# EAGLE design Monster_Moto_Shield (EAGLE 6.5.0)
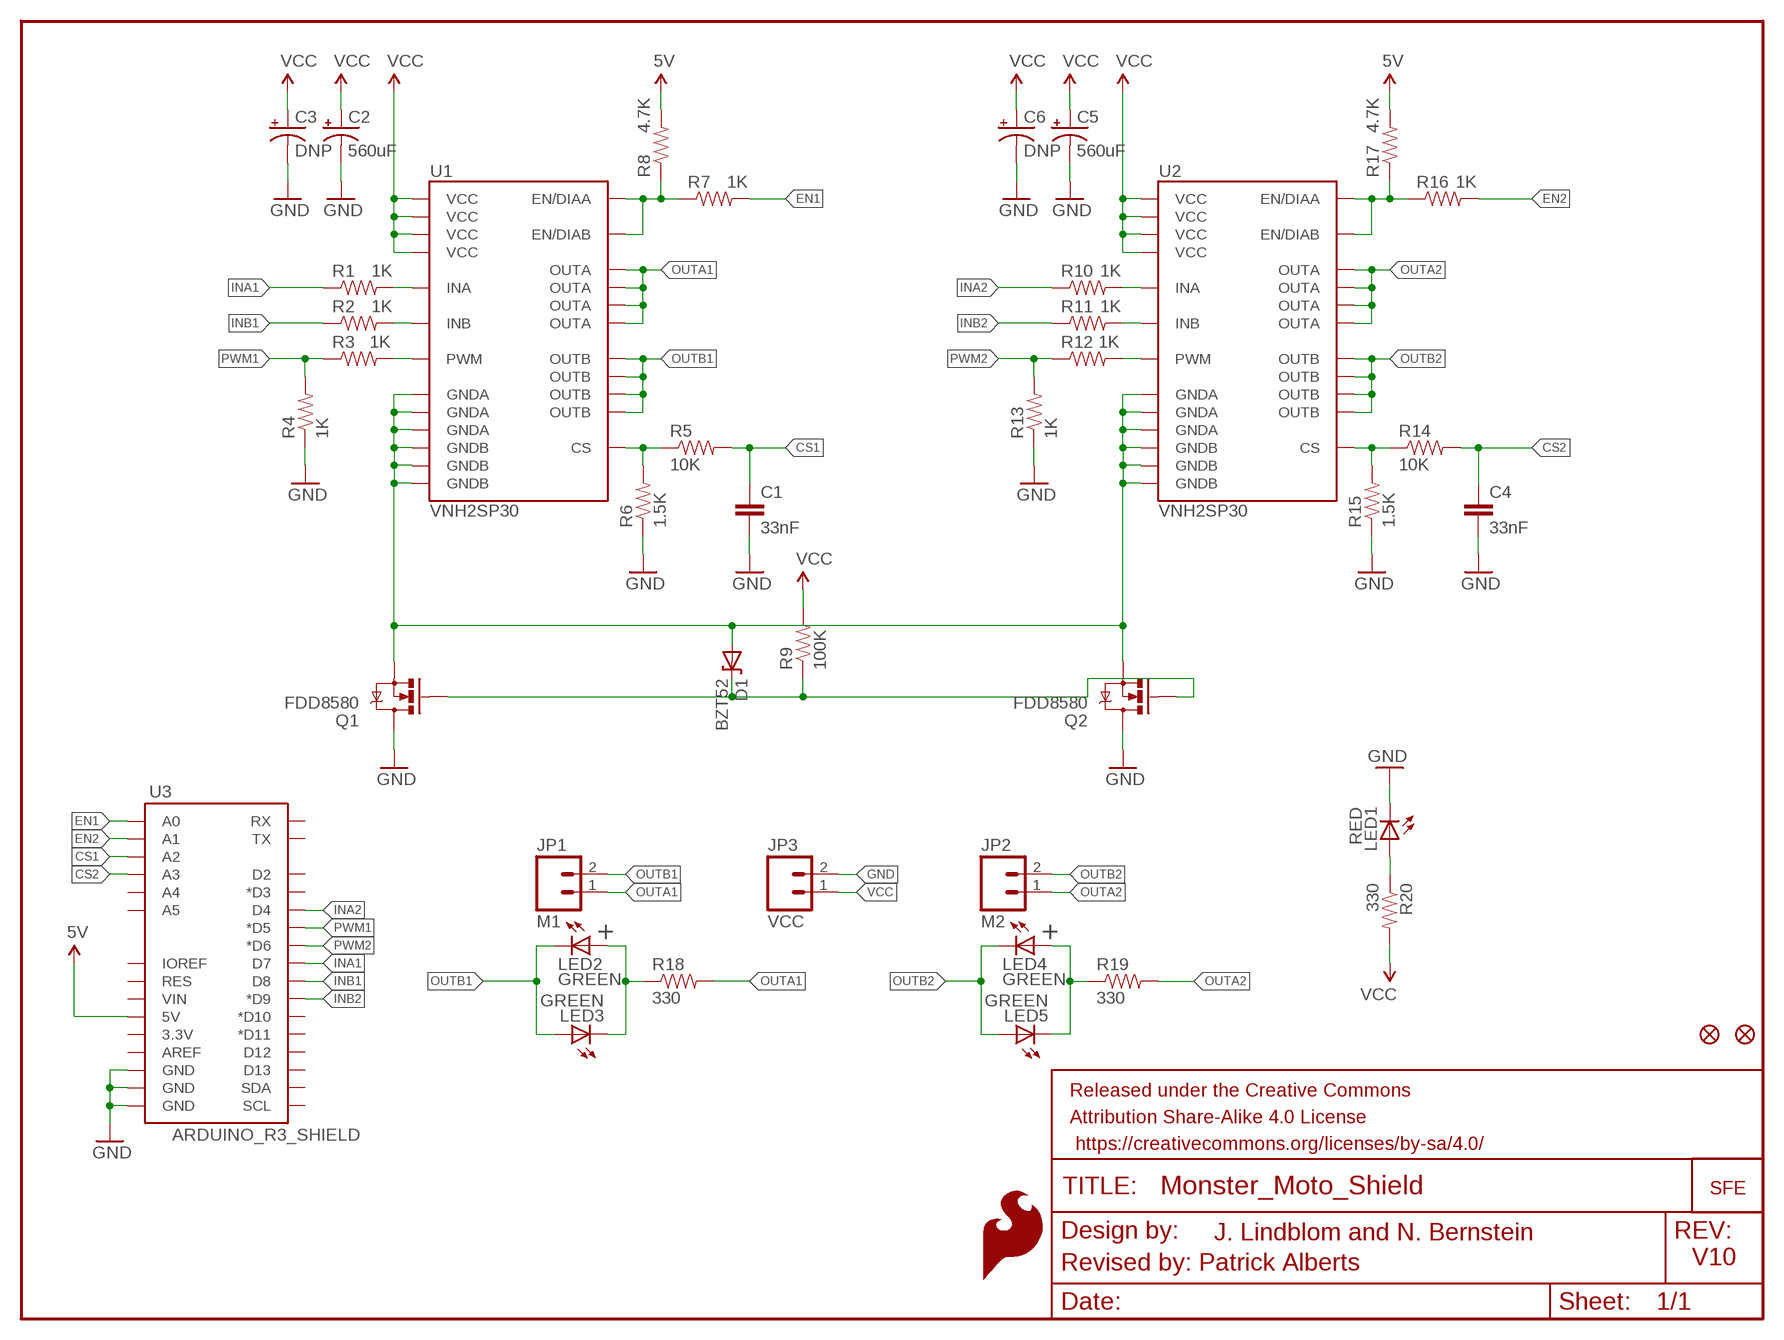
[diagram p0: schematic, sheet 1]

## Parts
C1  33nF  CAP0603-CAP  [0603-CAP]
C2  560uF  CAP_POLG  [PANASONIC_G]
C3  DNP  CAP_POLPTH4  [CPOL-RADIAL-1000UF-25V]
C4  33nF  CAP0603-CAP  [0603-CAP]
C5  560uF  CAP_POLG  [PANASONIC_G]
C6  DNP  CAP_POLPTH4  [CPOL-RADIAL-1000UF-25V]
D1  BZT52  DIODE-ZENER-BZT52  [SOD-323]
FRAME*  FRAME-LETTER  [CREATIVE_COMMONS]
JP1  M1  M02PTH4  [1X02_XTRA_BIG]
JP2  M2  M02PTH4  [1X02_XTRA_BIG]
JP3  VCC  M02PTH4  [1X02_XTRA_BIG]
JP4  FIDUCIAL1X2  [FIDUCIAL-1X2]
JP5  LOGO-SFENEW  [SFE-NEW-WEBLOGO]
JP6  FIDUCIAL1X2  [FIDUCIAL-1X2]
LED1  RED  LED-RED0603  [LED-0603]
LED2  GREEN  LED-GREEN0603  [LED-0603]
LED3  GREEN  LED-GREEN0603  [LED-0603]
LED4  GREEN  LED-GREEN0603  [LED-0603]
LED5  GREEN  LED-GREEN0603  [LED-0603]
LOGO1  SFE_LOGO_FLAME.2_INCH  [SFE_LOGO_FLAME_.2]
Q1  FDD8580  MOSFET-NCHANNELFDD8580  [DPAK]
Q2  FDD8580  MOSFET-NCHANNELFDD8580  [DPAK]
R1  1K  1KOHM1/10W1%(0603)  [0603-RES]
R2  1K  1KOHM1/10W1%(0603)  [0603-RES]
R3  1K  1KOHM1/10W1%(0603)  [0603-RES]
R4  1K  1KOHM1/10W1%(0603)  [0603-RES]
R5  10K  10KOHM1/10W1%(0603)0603  [0603-RES]
R6  1.5K  1.5KOHM1/10W1%(0603)  [0603]
R7  1K  1KOHM1/10W1%(0603)  [0603-RES]
R8  4.7K  4.7KOHM1/10W1%(0603)  [0603]
R9  100K  100KOHM1/10W1%(0603)  [0603-RES]
R10  1K  1KOHM1/10W1%(0603)  [0603-RES]
R11  1K  1KOHM1/10W1%(0603)  [0603-RES]
R12  1K  1KOHM1/10W1%(0603)  [0603-RES]
R13  1K  1KOHM1/10W1%(0603)  [0603-RES]
R14  10K  10KOHM1/10W1%(0603)0603  [0603-RES]
R15  1.5K  1.5KOHM1/10W1%(0603)  [0603]
R16  1K  1KOHM1/10W1%(0603)  [0603-RES]
R17  4.7K  4.7KOHM1/10W1%(0603)  [0603]
R18  330  33OHM1/10W1%(0603)  [0603]
R19  330  33OHM1/10W1%(0603)  [0603]
R20  330  33OHM1/10W1%(0603)  [0603]
U1  VNH2SP30  [VNH2SP30]
U2  VNH2SP30  [VNH2SP30]
U3  ARDUINO_R3_SHIELD  [UNO_R3_SHIELD]

## Nets
5V: R8.2 R17.2 U3.5V
CS1: C1.1 R5.2 U3.A2
CS2: C4.1 R14.2 U3.A3
EN1: R7.2 U3.A0
EN2: R16.2 U3.A1
GND: C1.2 C2.- C3.2(-) C4.2 C5.- C6.2(-) JP3.2 LED1.C Q1.4(D) Q2.4(D) R4.1 R6.1 R13.1 R15.1 U3.GND@0(GND) U3.GND@1(GND) U3.GND@2(GND)
INA1: R1.1 U3.D7
INA2: R10.1 U3.D4
INB1: R2.1 U3.D8
INB2: R11.1 U3.D9(*D9)
N$1: R2.2 U1.11(INB)
N$2: R1.2 U1.5(INA)
N$3: R11.2 U2.11(INB)
N$4: R10.2 U2.5(INA)
N$5: R3.2 U1.8(PWM)
N$6: R12.2 U2.8(PWM)
N$7: R5.1 R6.2 U1.9(CS)
N$8: R14.1 R15.2 U2.9(CS)
N$9: R16.1 R17.1 U2.6(EN/DIAA) U2.10(EN/DIAB)
N$10: D1.2(A) Q1.3(S) Q2.3(S) U1.18(GNDB) U1.19(GNDB) U1.20(GNDB) U1.26(GNDA) U1.27(GNDA) U1.28(GNDA) U2.18(GNDB) U2.19(GNDB) U2.20(GNDB) U2.26(GNDA) U2.27(GNDA) U2.28(GNDA)
N$12: R7.1 R8.1 U1.6(EN/DIAA) U1.10(EN/DIAB)
N$13: D1.1(C) Q1.1(G) Q2.1(G) R9.1
N$14: LED2.A LED3.C R18.1
N$16: LED4.A LED5.C R19.1
N$18: LED1.A R20.1
OUTA1: JP1.1 R18.2 U1.1(OUTA) U1.25(OUTA) U1.30(OUTA) U1.SLUG3(OUTA)
OUTA2: JP2.1 R19.2 U2.1(OUTA) U2.25(OUTA) U2.30(OUTA) U2.SLUG3(OUTA)
OUTB1: JP1.2 LED2.C LED3.A U1.15(OUTB) U1.16(OUTB) U1.21(OUTB) U1.SLUG2(OUTB)
OUTB2: JP2.2 LED4.C LED5.A U2.15(OUTB) U2.16(OUTB) U2.21(OUTB) U2.SLUG2(OUTB)
PWM1: R3.1 R4.2 U3.D5(*D5)
PWM2: R12.1 R13.2 U3.D6(*D6)
VCC: C2.+ C3.1(+) C5.+ C6.1(+) JP3.1 R9.2 R20.2 U1.3(VCC) U1.13(VCC) U1.23(VCC) U1.SLUG1(VCC) U2.3(VCC) U2.13(VCC) U2.23(VCC) U2.SLUG1(VCC)
Unconnected: U3.3.3V U3.A4 U3.A5 U3.AREF U3.D2 U3.D3(*D3) U3.D10(*D10) U3.D11(*D11) U3.D12 U3.D13 U3.IOREF U3.RES U3.RX U3.SCL U3.SDA U3.TX U3.VIN

## Notes on the sheet
- + | +
- J. Lindblom and N. Bernstein
- Revised by: Patrick Alberts | V10

## Library data of the parts
C1 C4 = SparkFun-Capacitors:CAP: Capacitor Standard 0603 ceramic capacitor, and 0.1" leaded capacitor.
C2 C3 C5 C6 = SparkFun:CAP_POL: Capacitor Polarized These are standard SMD and PTH capacitors. Normally 10uF, 47uF, and 100uF in electrolytic and tantalum varieties. Always verify the external diameter of the through hole cap, it varies with capacity, voltage, and manufacturer. The EIA devices should be standard.
D1 = SparkFun:DIODE-ZENER: Zener Diode Production Part - 8199 3.4V Zener Voltage
FRAME* = SparkFun-Aesthetics:FRAME-LETTER: Schematic Frame Standard 8.5x11 US Letter frame
JP1-JP3 = SparkFun:M02: Header 2 Standard 2-pin 0.1" header. Use with straight break away headers (SKU : PRT-00116), right angle break away headers (PRT-00553), swiss pins (PRT-00743), machine pins (PRT-00117), and female headers (PRT-00115). Molex polarized connector foot print use with SKU : PRT-08233 with associated crimp pins and housings.
JP4 JP6 = SparkFun:FIDUCIAL: Fiducial Alignment Points Various fiducial points for machine vision alignment.
JP5 = SparkFun:LOGO-SFE: Spark Fun Electronics PCB Logo This is the standard Spark Fun Electronics PCB logo.
LED1 = SparkFun-LED:LED-RED: Assorted Red LEDs LilyPad 1206- DIO-09912 1206- DIO-00809 0603- DIO-00819; PROD_ID: DIO-00819
LED2-LED5 = SparkFun-LED:LED-GREEN: Various green LEDs Green LEDs used in SFE Production 0603- DIO-00821 LARGE- DIO-00862 LILYPAD- DIO-09910; PROD_ID: DIO-00821
LOGO1 = SparkFun-Aesthetics:SFE_LOGO_FLAME: SFE Logo, flame only This is the SparkFun flame logo. The logo on the schematic will always be the same size; the package variant is the height of the flame. Default layer for the logo on the board is tSilk.
Q1 Q2 = SparkFun:MOSFET-NCHANNEL
R1-R4 R7 R10-R13 R16 = SparkFun-Resistors:1KOHM1/10W1%(0603): RES-07856; PROD_ID: RES-07856
R5 R14 = SparkFun-Resistors:10KOHM1/10W1%(0603): RES-00824; PROD_ID: RES-00824
R6 R15 = SparkFun-Resistors:1.5KOHM1/10W1%(0603): RES-08306; PROD_ID: RES-08306; VALUE: 1.5KOHM
R8 R17 = SparkFun-Resistors:4.7KOHM1/10W1%(0603): RES-07857; PROD_ID: RES-07857
R9 = SparkFun-Resistors:100KOHM1/10W1%(0603): RES-07828; PROD_ID: RES-07828; VALUE: 100k
R18-R20 = SparkFun-Resistors:33OHM1/10W1%(0603): RES-08270; PROD_ID: RES-08270; VALUE: 33OHM
U1 U2 = SparkFun:VNH2SP30
U3 = SparkFun-Boards:ARDUINO_R3_SHIELD: Shield form compatible with the Arduino Uno R3.

## Board
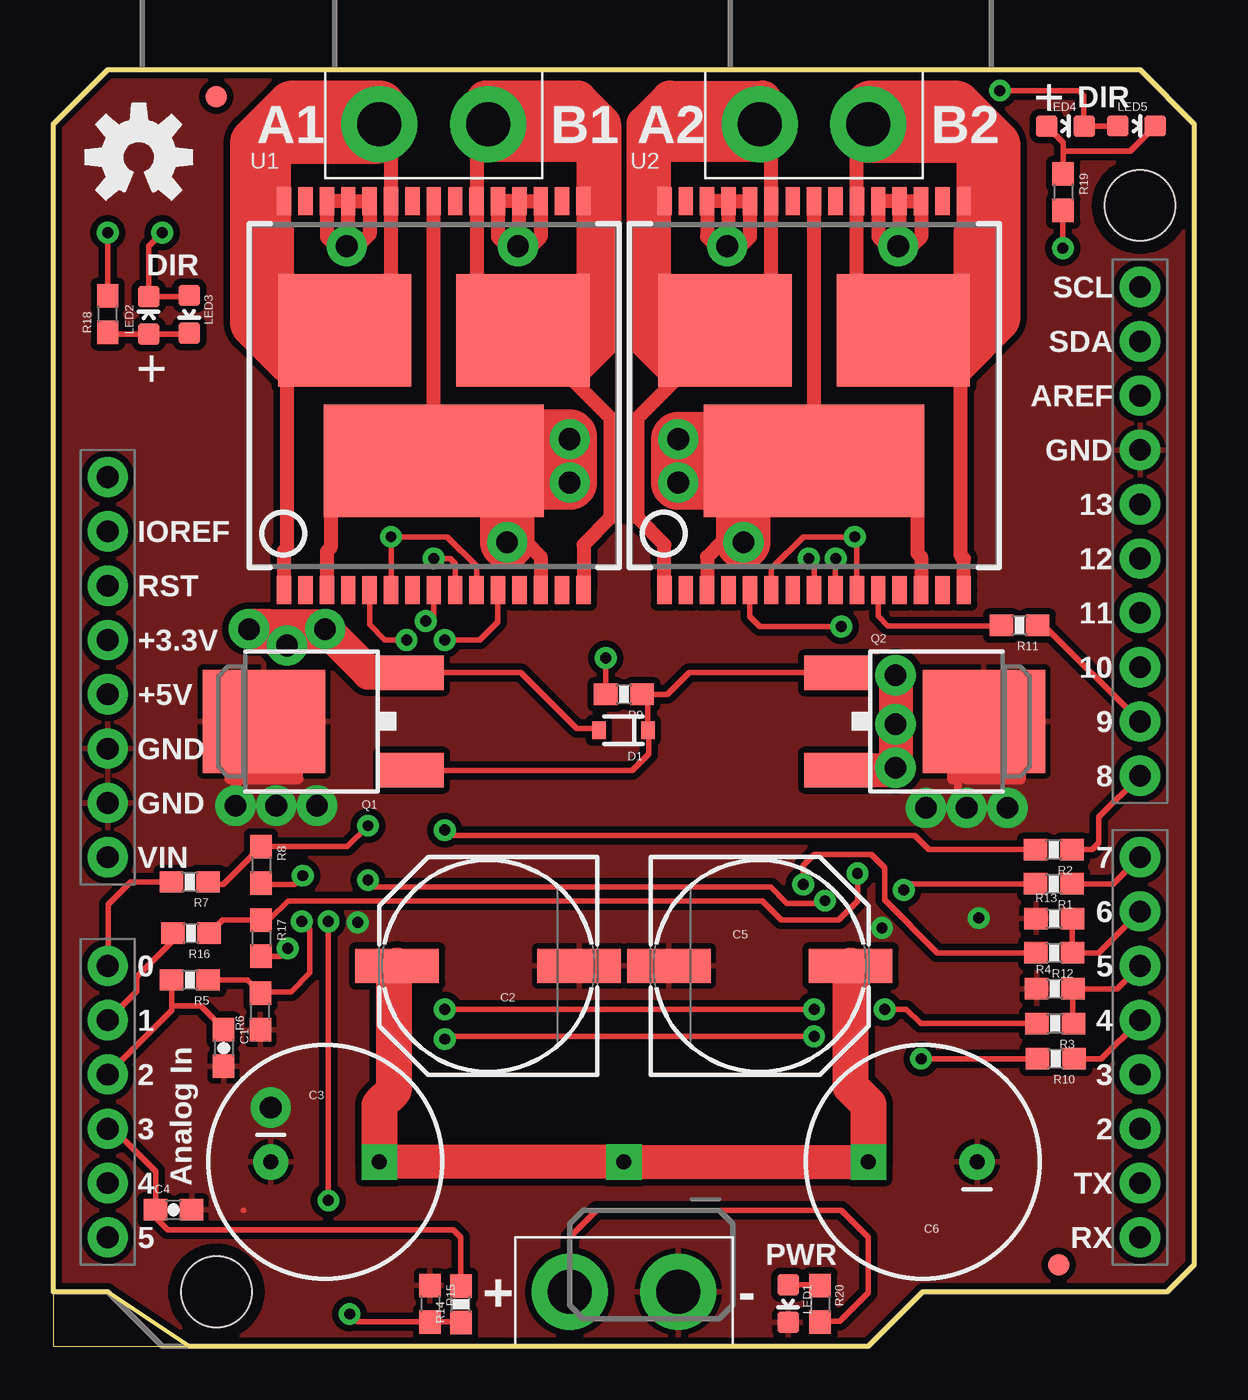
[diagram p1: board, top side]
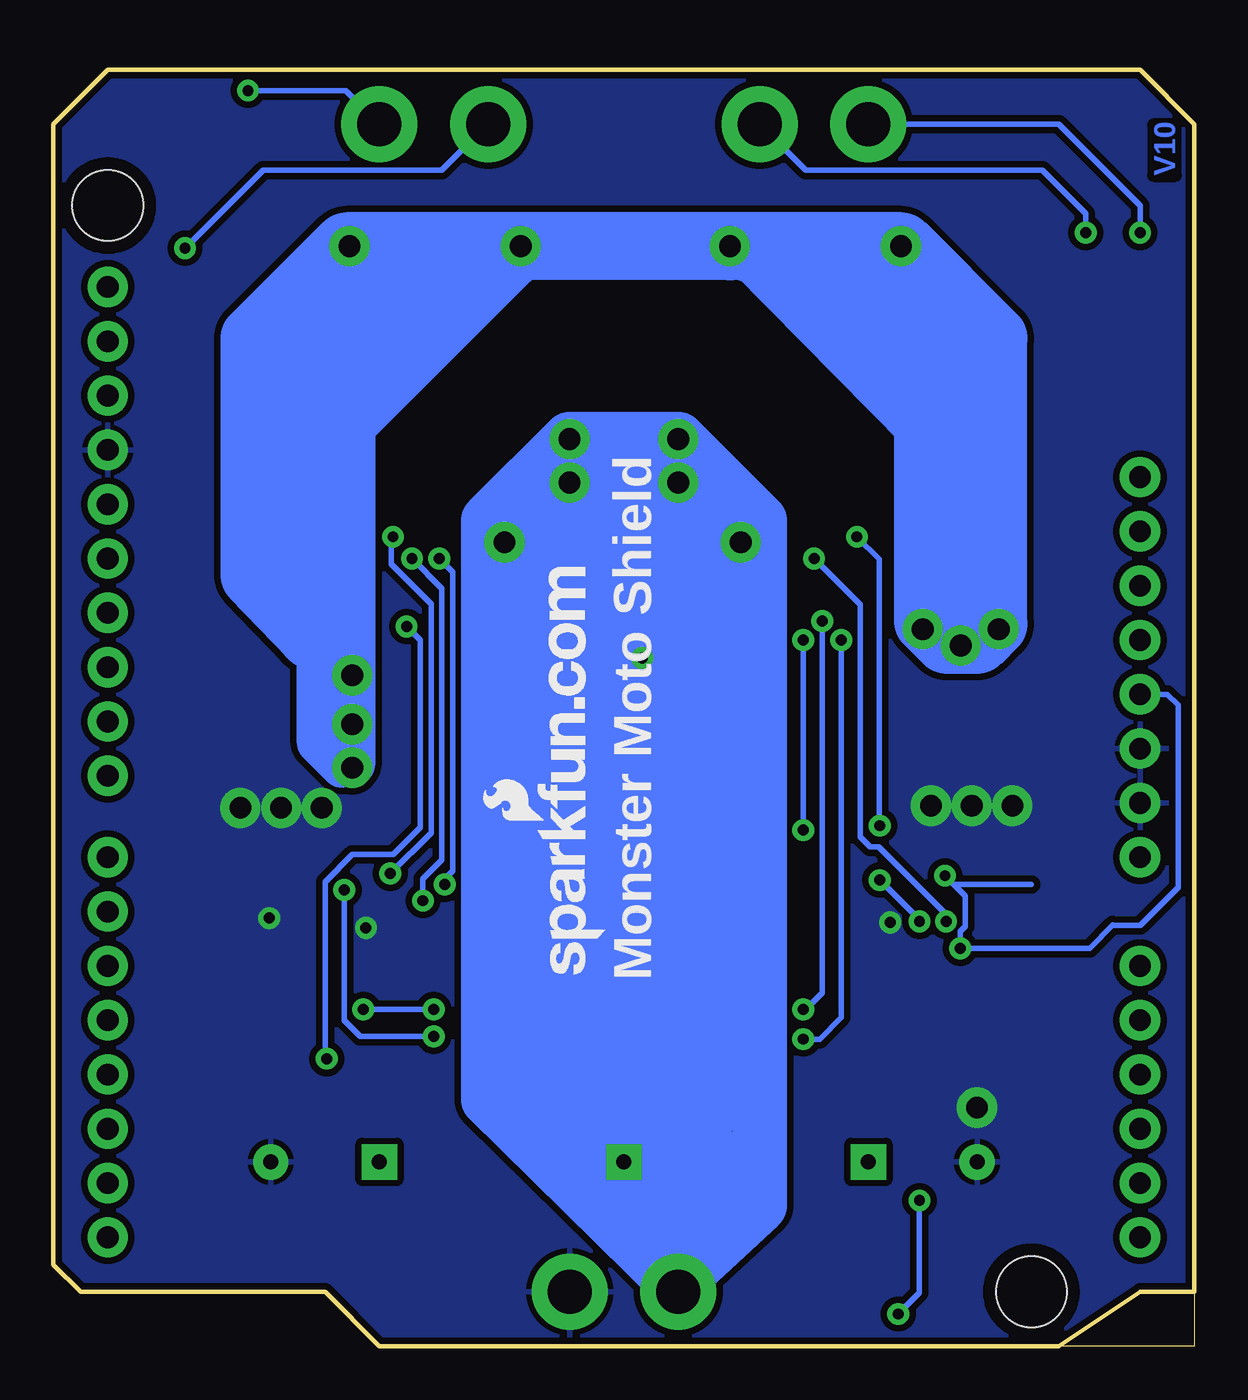
[diagram p2: board, bottom side, seen from below]

Size 53.34 x 59.69 mm. Coordinates in mm from the lower left corner, seen from the top.
Outline: 6.35,0 0,0 0,2.54
Outline: 0,2.54 2.54,2.54 6.35,0
Outline: 6.35,0 38.1,0 40.64,2.54 52.07,2.54 53.34,3.81 53.34,57.15 50.8,59.69 2.54,59.69 0,57.15 0,2.54
Copper layers (1*16): Top 0.035mm / dielectric 1.5mm / Bottom 0.035mm
Design rules "SparkFun-2-layer": minimum track width 7mil, minimum drill 15mil, track to track 8mil, track to pad 8mil, pad to pad 8mil, via to via 8mil, smd to smd 8mil, copper to edge 8mil, drill to drill 8mil, minimum pad ring 12mil, minimum via ring 10mil, stop-mask expansion 4mil, vias tented up to drill 20mil, thermal gap 10mil

### Footprints (pad centres in the part's own frame; a part is rotated, then mirrored left to right if it is on the bottom)
0603-CAP = smd 1.1 x 1: 1 -0.85,0; 2 0.85,0
PANASONIC_G = smd 3.9 x 1.6: + 4.25,0; - -4.25,0
CPOL-RADIAL-1000UF-25V = drill 0.7 pad 1.651 square: 1 2.54,0 | drill 0.7 pad 1.651: 2 -2.54,0
SOD-323 = smd 0.63 x 0.83: 1 -1.15,0; 2 1.15,0
1X02_XTRA_BIG = drill 2.057 pad 3.556: 1 -2.54,0; 2 2.54,0
FIDUCIAL-1X2 = smd 1 x 1: 1 0,0
LED-0603 = smd 1 x 1: A 0,-0.877; C 0,0.877
DPAK = smd 1.6 x 3: 1 -2.28,-5.31; 3 2.28,-5.31 | smd 4.826 x 5.715: 4 0,1.588
0603-RES = smd 1.1 x 1: 1 -0.85,0; 2 0.85,0
0603 = smd 1.1 x 1: 1 -0.85,0; 2 0.85,0
VNH2SP30 = smd 0.67 x 1.3: 1 -7,-9.1; 2 -6,-9.1; 3 -5,-9.1; 4 -4,-9.1; 5 -3,-9.1; 6 -2,-9.1; 7 -1,-9.1; 8 0,-9.1; 9 1,-9.1; 10 2,-9.1; 11 3,-9.1; 12 4,-9.1; 13 5,-9.1; 14 6,-9.1; 15 7,-9.1; 16 7,9.1; 17 6,9.1; 18 5,9.1; 19 4,9.1; 20 3,9.1; 21 2,9.1; 22 1,9.1; 23 0,9.1; 24 -1,9.1; 25 -2,9.1; 26 -3,9.1; 27 -4,9.1; 28 -5,9.1; 29 -6,9.1; 30 -7,9.1 | smd 10.3 x 5.25: SLUG1 0,-3.05 | smd 6.23 x 5.25: SLUG2 4.165,3.05; SLUG3 -4.165,3.05
UNO_R3_SHIELD = drill 1.016 pad 1.88: 3.3V 50.8,26.67; 5V 50.8,29.21; A0 50.8,41.91; A1 50.8,44.45; A2 50.8,46.99; A3 50.8,49.53; A4 50.8,52.07; A5 50.8,54.61; AREF 2.54,15.24; D2 2.54,49.53; D3 2.54,46.99; D4 2.54,44.45; D5 2.54,41.91; D6 2.54,39.37; D7 2.54,36.83; D8 2.54,33.02; D9 2.54,30.48; D10 2.54,27.94; D11 2.54,25.4; D12 2.54,22.86; D13 2.54,20.32; GND@0 50.8,31.75; GND@1 50.8,34.29; GND@2 2.54,17.78; IOREF 50.8,21.59; NC 50.8,19.05; RES 50.8,24.13; RX 2.54,54.61; SCL 2.54,10.16; SDA 2.54,12.7; TX 2.54,52.07; VIN 50.8,36.83
STAND-OFF = hole 3.302: 0,0

### Placement (x,y rotation side)
C1  7.96,13.94 270 top
C2  20.32,17.78 180 top
C3  12.7,8.61 0 top
C4  5.61,6.38 0 top
C5  33.02,17.78 0 top
C6  40.64,8.61 180 top
D1  26.64,28.8 180 top
FRAME*  -3.28,-13.97 0 top  (outside the outline)
JP1  17.78,57.15 0 top
JP2  35.56,57.15 0 top
JP3  26.67,2.54 0 top
JP4  7.62,58.42 0 top
JP5  27.56,17.4 90 bottom
JP6  46.99,3.81 0 top
LED1  34.34,1.98 180 top
LED2  4.45,48.21 0 top
LED3  6.35,48.26 180 top
LED4  47.3,57.06 270 top
LED5  50.63,57.06 270 top
Q1  11.43,29.21 90 top
Q2  41.91,29.21 270 top
R1  46.76,21.62 180 top
R2  46.76,23.22 180 top
R3  46.84,15.09 180 top
R4  46.81,16.71 0 top
R5  6.38,17.12 180 top
R6  9.68,15.65 90 top
R7  6.37,21.71 180 top
R8  9.7,22.5 270 top
R9  26.67,30.48 180 top
R10  46.86,13.44 180 top
R11  45.16,33.71 180 top
R12  46.79,18.39 180 top
R13  46.79,19.99 0 top
R14  19.05,1.96 90 top
R15  17.6,1.98 270 top
R16  6.43,19.3 180 top
R17  9.7,19.08 270 top
R18  2.54,48.26 90 top
R19  47.2,53.96 270 top
R20  35.84,1.98 270 top
U1  17.78,44.45 0 top
U2  35.56,44.45 0 top
U3  53.34,59.69 180 top
U$3  [OSHW-LOGO-M]  3.99,55.6 0 top
U$4  [STAND-OFF]  7.62,2.54 0 top
U$6  [STAND-OFF]  50.8,53.34 0 top

### Tracks (layer width: path | path; a pad name or v marks a point on that pad's centre or on a via)
5V  (via drill 0.51)
  Top 0.254: R8.2 10.1,21.65 10.16,21.59 11.25,21.59 v11.66,22 | R17.2 10.58,18.23 v10.95,18.59
  Bottom 0.254: U3.5V 1.27,30.48 0.76,29.97 0.76,21.45 2.54,19.67 3.79,19.67 3.81,19.68 4.9,18.59 v10.95,18.59 10.95,19.39 10.71,19.62 10.71,21.05 11.25,21.59 | 7.62,21.59 11.25,21.59 | 11.25,21.59 v11.66,22
CS1
  Top 0.254: C1.1 7.96,14.85 6.89,15.91 5.53,15.91 | U3.A2 5.53,15.69 5.53,15.91 | 5.53,15.91 R5.2
CS2
  Top 0.254: 19.07,2.83 R14.2 19.05,5.08 18.69,5.44 5.33,5.44 4.78,5.99 4.78,6.39 | U3.A3 2.79,10.16 4.78,8.18 4.78,6.39 | 4.78,6.39 C4.1
EN1
  Top 0.254: U3.A0 2.56,17.8 2.56,20.65 3.62,21.71 R7.2
EN2
  Top 0.254: U3.A1 3.89,16.59 3.89,17.26 5.58,18.95 R16.2
GND  (via drill 0.51, 1.02 pad 1.88)
  Top 0.254: 8.88,6.34 8.89,6.35 | 42.16,26.54 42.67,26.54 43.05,26.54 43.18,26.67 41.91,26.67 | 42.16,26.54 42.04,26.67 | 42.16,26.54 42.16,26.42 42.29,26.29
  Top 0.381: v8.51,25.27 8.51,26.29 8.89,26.54 | 42.29,25.27 42.29,26.29
  Top 0.508: 8.26,26.92 8.26,26.54 8.89,26.54 11.43,26.54 11.43,26.92 | 42.04,26.54 42.04,26.67 42.04,26.92 | 42.67,26.54 45.21,26.54 45.21,26.92
  other vias: 43.26,20.02 38.73,19.56 44.6,25.17 40.79,25.17 12.32,25.27 42.7,25.17 10.41,25.27 10.16,11.15 14.22,19.81
  pour Top (isolate 0.305): 0,2.54 0,57.15 2.54,59.69 50.8,59.69 53.34,57.15 53.34,3.81 52.07,2.54 40.64,2.54 38.1,0 6.35,0 2.54,2.54
  pour Bottom (isolate 0.305): 6.35,0 2.54,2.54 0,2.54 0,57.15 2.54,59.69 50.8,59.69 53.34,57.15 53.34,3.81 52.07,2.54 40.64,2.54 38.1,0
INA1
  Top 0.254: R1.1 49.55,21.61 U3.D7
INA2
  Top 0.254: R10.1 49,13.44 U3.D4
INB1
  Top 0.254: R2.1 48.56,23.22 48.87,23.52 48.87,24.74 U3.D8
INB2
  Top 0.254: R11.1 46.3,33.71 U3.D9
N$1  (via drill 0.51)
  Top 0.254: v18.29,33.02 19.94,33.02 20.78,33.86 U1.11 | v18.29,24.13 18.54,23.88 40.26,23.88 40.92,23.22 R2.2
  Bottom 0.254: v18.29,24.13 v18.29,33.02
N$2  (via drill 0.51)
  Top 0.254: v35.56,14.48 18.41,14.48 v18.29,14.35 | U1.5 14.78,33.73 15.49,33.02 v16.51,33.02 | v39.75,21.34 40.03,21.61 R1.2
  Bottom 0.254: v39.75,21.34 39.75,15.24 38.99,14.48 v35.56,14.48 | v18.29,14.35 17.53,14.35 16.51,15.37 v16.51,33.02
N$3
  Top 0.254: U2.11 38.56,34.13 39.01,33.68 44.29,33.68 R11.2
N$4  (via drill 0.51)
  Top 0.254: U2.5 32.56,34.12 33.02,33.66 v36.83,33.66 | v40.56,13.44 R10.2
  Bottom 0.254: v36.83,33.66 36.2,33.02 36.2,24.26 37.47,22.99 39.37,22.99 40.64,21.72 40.64,13.51 v40.56,13.44
N$5  (via drill 0.51)
  Top 0.254: U1.8 17.78,33.91 v17.4,33.91 | v18.29,15.75 v35.56,15.75 | v38.86,15.75 39.88,15.75 40.54,15.09 R3.2
  Bottom 0.254: v35.56,15.75 v38.86,15.75 | v18.29,15.75 18.16,15.75 17.4,16.51 v17.4,33.91
N$6  (via drill 0.51)
  Top 0.254: U2.8 35.56,36.58 v35.31,36.83 | v35.05,21.59 35.05,22.48 35.56,22.99 38.23,22.99 38.86,22.35 38.86,20.85 41.33,18.39 R12.2
  Bottom 0.254: v35.05,21.59 35.05,21.84 34.67,22.23 34.67,36.2 v35.31,36.83
N$7  (via drill 0.51)
  Top 0.254: U1.9 18.78,36.59 18.54,36.83 v17.78,36.83 | 9.65,16.52 R6.2 | R6.2 9.75,16.57 11.11,16.57 11.99,17.45 11.99,19.48 v11.61,19.86 | R6.2 9.05,17.12 R5.1
  Bottom 0.254: v17.78,36.83 15.62,34.67 15.62,23.8 15.16,23.34 14.76,23.34 11.61,20.19 v11.61,19.86
N$8  (via drill 0.51)
  Top 0.254: U2.9 36.56,36.81 v36.58,36.83 | v36.07,20.83 35.94,20.7 34.29,20.7 33.53,21.46 14.99,21.46 14.99,21.51 v14.71,21.79 | v12.85,19.86 v12.85,6.81 | R15.2 19.02,1.13 R14.1 | 17.59,1.12 R15.2 | v13.84,1.5 14.21,1.13 R15.2
  Bottom 0.254: v36.58,36.83 35.18,35.43 35.18,22.73 36.07,21.84 v36.07,20.83 | v12.85,19.86 12.93,19.86 12.93,20.02 v14.71,21.79 | v12.85,6.81 12.85,2.49 v13.84,1.5
N$9  (via drill 0.51)
  Top 0.254: U2.10 37.56,37.75 v37.47,37.85 35.05,37.85 33.56,36.35 U2.6 | v37.59,22.1 37.59,20.83 36.7,19.94 34.04,19.94 33.15,20.83 10.97,20.83 10.07,19.93 R17.1 | 9.68,19.9 R17.1 | R16.1 7.9,19.93 R17.1
  Bottom 0.254: v37.59,22.1 35.69,24 35.69,34.7 37.56,36.58 37.56,37.75 v37.47,37.85
N$10  (via drill 1.02 pad 1.88)
  Top 0.254: Q1.3 21.85,31.49 24.46,28.88 25.42,28.88 D1.2
  Top 0.645: U2.19 U2.18 40.56,51.86 40.13,51.44 | U2.19 U2.20 38.56,51.86 38.99,51.44 | U1.27 U1.28 12.78,52.07 12.78,51.86 13.21,51.44 | U1.19 U1.20 20.78,51.86 21.21,51.44 | U1.19 U1.18 22.78,51.86 22.35,51.44 | U2.27 U2.28 30.56,51.86 30.99,51.44 | U1.19 21.78,51.5 v21.72,51.44 | U1.27 13.78,51.5 v13.72,51.44 | U2.19 39.56,51.5 v39.5,51.44 | U1.27 U1.26 14.78,51.99 14.22,51.44 | U2.27 U2.26 32.56,51.86 | 31.56,51.5 U2.27 | v31.5,51.44 31.56,51.5 | 31.56,51.5 32.2,51.5 32.51,51.82
  Top 1.6: Q1.3 14.74,31.49 v12.7,33.53 | Q2.3 39.25,26.93 v39.37,27.05 v39.37,31.37
  Top 1.88: v12.7,33.53 v9.14,33.53 10.16,33.53 v10.92,32.77
  Bottom 0.254: 11.05,43.56 11.05,38.48 11.43,38.1 12.32,38.1 12.45,43.18
  Bottom 0.645: 32,51.18 32,51.05 | 32,51.31 31.62,51.31 v31.5,51.44
  Bottom 1.6: 41.66,39.88 41.66,35.81 | v39.37,29.08 40.89,29.08 41.02,29.21 | v39.37,31.37 39.5,31.37 39.88,31.75 | 41.66,39.88 41.66,44.2 | 41.66,39.88 40.39,39.88 39.88,43.18
  Bottom 1.88: v9.14,33.53 9.4,33.78 | v39.37,31.37 39.24,31.37 39.24,27.18 v39.37,27.05 39.88,27.05 41.02,28.19 41.02,29.21 41.02,32.26
  Bottom 3.175: 20.7,51.31 20.45,51.31 12.45,43.18 12.45,33.91 11.56,33.02 10.16,33.02 9.4,33.78 9.4,47.12 v13.72,51.44 v21.72,51.44 v31.5,51.44 v39.5,51.44 39.62,51.44 43.94,47.12 43.94,36.07 41.27,33.27 | 39.88,31.5 39.88,31.75 39.88,43.18 32,51.05 31.75,51.31 | 32,51.31 32,51.18
  Bottom 5.08: 11.05,43.56 17.27,49.78 | 41.66,44.2 36.83,49.02
N$12  (via drill 0.51)
  Top 0.254: U1.10 19.78,36.48 18.41,37.85 v15.78,37.85 U1.6 | 9.73,23.35 R8.1 | R8.1 13.73,23.35 v14.71,24.33 | R8.1 7.94,21.59 7.62,21.59 7.5,21.71 R7.1
  Bottom 0.254: v15.78,37.85 14.73,36.8 14.73,24.36 v14.71,24.33
N$13
  Top 0.254: Q1.1 27.06,26.93 27.82,27.69 27.82,28.78 D1.1 27.8,30.2 R9.1 28.7,30.48 29.71,31.49 Q2.1
N$14
  Top 0.254: 2.64,47.51 R18.1 2.62,47.33 LED2.A 6.3,47.33 LED3.C
N$16
  Top 0.254: LED4.A 47.2,56.29 47.2,55.88 | 47.2,55.88 R19.1 | LED5.C 50.33,55.88 47.2,55.88
N$18
  Top 0.254: LED1.A 35.81,2.86 R20.1
OUTA1  (via drill 0.51)
  Top 0.254: JP1.1 14.73,57.15 | v2.54,52.07 R18.2
  Top 0.61: 10.92,46.48 11.43,46.99 13.11,46.99 U1.SLUG3 15.78,49.66
  Top 0.645: U1.1 10.78,37.2 10.92,37.34 10.92,45.72 10.92,46.48 | 15.78,49.66 U1.25 15.78,56.61 JP1.1 | 11.43,46.99 10.92,47.5 10.92,52.2 10.78,52.34 U1.30 10.78,56.66 10.67,56.77 | 10.79,46.35 11.18,46.23 | 10.67,46.1 11.05,46.1 | 10.79,55.75 10.92,55.88 10.29,55.88 10.16,56.01 | 10.03,56.01 9.4,56.01 9.53,56.26
  Top 0.762: 11.43,46.99 10.79,46.35 | 10.67,46.1 10.16,46.61 10.16,49.15 10.54,49.15
  Top 1.143: 10.03,56.01 10.16,56.01 | 10.67,46.1 10.67,45.97 10.92,45.72
  Top 1.397: 10.16,56.01 15.24,56.01
  Top 2.032: 14.73,57.15 11.81,57.15
  Top 2.54: 11.18,46.23 9.53,47.88 9.53,56.26 11.18,57.91 15.24,57.91
  Top 3.81: 13.36,47.75 U1.SLUG3
  Bottom 0.254: JP1.1 6.35,57.15 2.54,53.34 v2.54,52.07
OUTA2  (via drill 0.51)
  Top 0.254: 27.69,57.15 28.19,56.64 | JP2.1 33.15,57.15 33.4,56.9 | 27.69,49.02 27.81,48.39 30.05,46.15 | v47.19,51.34 R19.2
  Top 0.645: U2.1 28.56,37.48 27.3,38.73 27.3,43.41 30.05,46.15 U2.SLUG3 | U2.SLUG3 28.7,49.81 28.7,49.66 28.56,49.8 U2.30 28.56,55.87 28.57,55.88 | U2.SLUG3 33.56,49.66 U2.25 33.56,56.23 33.27,56.52
  Top 0.671: 33.4,56.9 33.53,56.77
  Top 1.143: 27.69,49.02 29.08,47.37
  Top 1.168: 27.94,47.5 28.19,47.24 27.69,47.12
  Top 1.778: 33.15,58.29 28.83,58.29 27.69,57.15 27.69,49.02 27.69,47.12 28.83,45.97
  Top 2.54: 28.19,56.64 33.15,56.64 33.4,56.9
  Bottom 0.254: JP2.1 35.18,54.99 43.54,54.99 v47.19,51.34
OUTB1  (via drill 0.51)
  Top 0.254: 25.15,56.64 25.65,57.15 | v5.08,52.07 4.45,51.44 LED2.C 6.3,49.09 LED3.A
  Top 0.61: 22.66,46.79 U1.SLUG2 19.78,49.66
  Top 0.645: U1.15 24.78,37.48 26.04,38.73 26.04,43.41 22.66,46.79 24.64,48.77 24.64,49.66 24.78,49.8 U1.16 | 19.78,49.66 U1.21 19.78,56.61 20.13,56.96 JP1.2
  Top 0.671: U1.16 24.78,56.5 24.13,57.15
  Top 1.143: 25.65,49.02 24.51,47.62
  Top 1.168: 25.65,47.12 25.59,47.05 25.15,47.24 25.02,47.24 | 25.02,47.24 24.89,47.24 | 25.02,47.24 25.15,47.37
  Top 1.778: 20.19,58.29 24.51,58.29 25.65,57.15 25.65,49.02 25.65,47.12 | 25.59,47.05 24.51,45.97
  Top 2.54: 25.15,56.64 20.45,56.64 20.13,56.96 19.94,57.15
  Bottom 0.254: JP1.2 18.16,54.99 7.11,54.99 5.08,52.96 v5.08,52.07
OUTB2  (via drill 0.51)
  Top 0.254: 42.42,46.48 42.42,46.99 42.16,47.24 | 42.16,47.24 41.91,47.5 | 42.16,47.24 42.42,47.5 | 42.16,47.24 41.91,46.99 | LED5.A LED4.C | LED4.C | LED4.C 48.16,57.08 48.16,58.49 47.93,58.72 v44.25,58.72
  Top 0.645: U2.15 42.56,36.81 42.42,36.96 42.42,45.72 42.16,45.97 | U2.SLUG2 37.56,49.66 U2.21 37.56,56.61 JP2.2 | 42.42,47.5 42.42,52.2 42.56,52.34 U2.16 42.56,56.37 42.16,56.26
  Top 0.762: 43.43,49.15 42.93,49.15 42.93,48.26 | 42.93,48.26 42.93,48.01 | U2.SLUG2 41.4,47.5 41.91,46.99 | 42.42,47.5 42.42,47.75 42.93,48.26 | 42.04,46.23 42.42,46.48
  Top 1.88: 42.16,45.97 42.04,46.23 | 42.16,56.26 38.1,56.26 38.1,56.64
  Top 2.54: 42.04,46.23 43.94,48.13 43.94,56.13 42.16,57.91 38.23,57.91
  Top 3.81: U2.SLUG2
  Bottom 0.254: JP2.2 39.67,58.72 v44.25,58.72
PWM1
  Top 0.254: U3.D5 49.73,16.71 R4.2 47.66,15.11 R3.1
PWM2
  Top 0.254: R13.2 R12.1 48.87,18.39 U3.D6
VCC  (via drill 0.51, 0.7 pad 1.65, 1.02 pad 1.88)
  Top 0.254: v25.82,32.18 R9.2 | JP3.1 24.13,5.08 25.4,6.35 36.83,6.35 38.1,5.08 38.1,2.5 36.75,1.15 35.86,1.15 R20.2
  Top 0.61: 22.86,40.39 22.78,40.31 | 12.95,39.62 13.97,40.64 17.78,40.64 | 20.32,42.55 21.27,41.59 22.61,40.26 | 40.39,39.62 39.37,40.64 35.56,40.64
  Top 0.645: U1.3 12.78,37.16 12.95,37.34 12.95,39.62 | U2.13 40.56,36.91 40.39,37.08 40.39,39.62 | 17.78,40.64 U1.23 | 35.56,40.64 U2.SLUG1 U2.23 | v24.13,42.42 24.13,42.55 | U1.13 22.78,36.91 22.1,37.59 v21.21,37.59 | U2.3 30.56,36.91 31.24,37.59 31.75,37.59 32.26,38.1
  Top 1.6: C3.1 v26.67,8.61 C6.1
  Top 1.676: C5.+ 37.26,12.14 38.1,11.3 C6.1 | C2.+ 15.9,17.61 15.9,11.94 15.24,11.28 C3.1
  Top 2.54: v24.13,40.39 24.13,41.91 | v24.13,40.39 22.86,40.39 18.79,40.39 U1.SLUG1 | v24.13,42.42 v24.13,40.39 | 24.13,42.55 20.32,42.55 19.68,42.55 17.78,40.64 | 31.75,42.42 v29.21,42.42 v29.21,40.39 31.75,40.39 | 31.75,42.42 33.78,42.42 35.56,40.64 | v21.21,37.59 21.21,41.53 21.27,41.59 | v32.26,37.59 32.26,38.1 32.26,41.91 31.75,42.42
  Bottom 0.254: 24.13,40.64 v24.13,40.39 24.38,40.39 | 20.32,6.58 20.32,6.71
  Bottom 0.508: 21.59,9.75 28.07,11.02 | 21.59,9.75 21.46,9.75 | 20.32,6.71 20.32,8.48 21.59,9.75 | 26.67,9.88 v26.67,8.61
  Bottom 0.645: v25.82,32.18 26.42,31.75 26.67,32
  Bottom 1.6: 24.13,3.05 24.13,7.34
  Bottom 11.43: 26.67,12.7 26.67,32 26.67,36.83
  Bottom 2.54: JP3.1 24.13,2.79 | 20.32,6.58 24.13,3.05 24.13,2.79 | 24.13,2.79 33.02,11.53 33.02,38.61 | 24.38,40.39 23.88,40.39 | 20.32,6.71 20.32,38.61 v24.13,42.42 v29.21,42.42 32.89,38.73
  Bottom 6.452: 26.67,9.88 26.67,12.7
  Bottom 6.858: 24.13,7.34 26.67,9.88

### Text on the board
Bottom: V10
tPlace: A1 | A2 | + | DIR | B1 | B2 | DIR | + | PWR | + | -
bPlace: Monster Moto Shield
tDocu: J. Lindblom and N. Bernstein | Revised by: Patrick Alberts